# EasyEDA schematic Train_Barrier.json
TITLE: Train Barrier controler; REV: o.0; Date: 2022-07-04; Sheet: 1/1; Drawn By: AmirB@mada.org.il; Company: Blomfield Science Museum
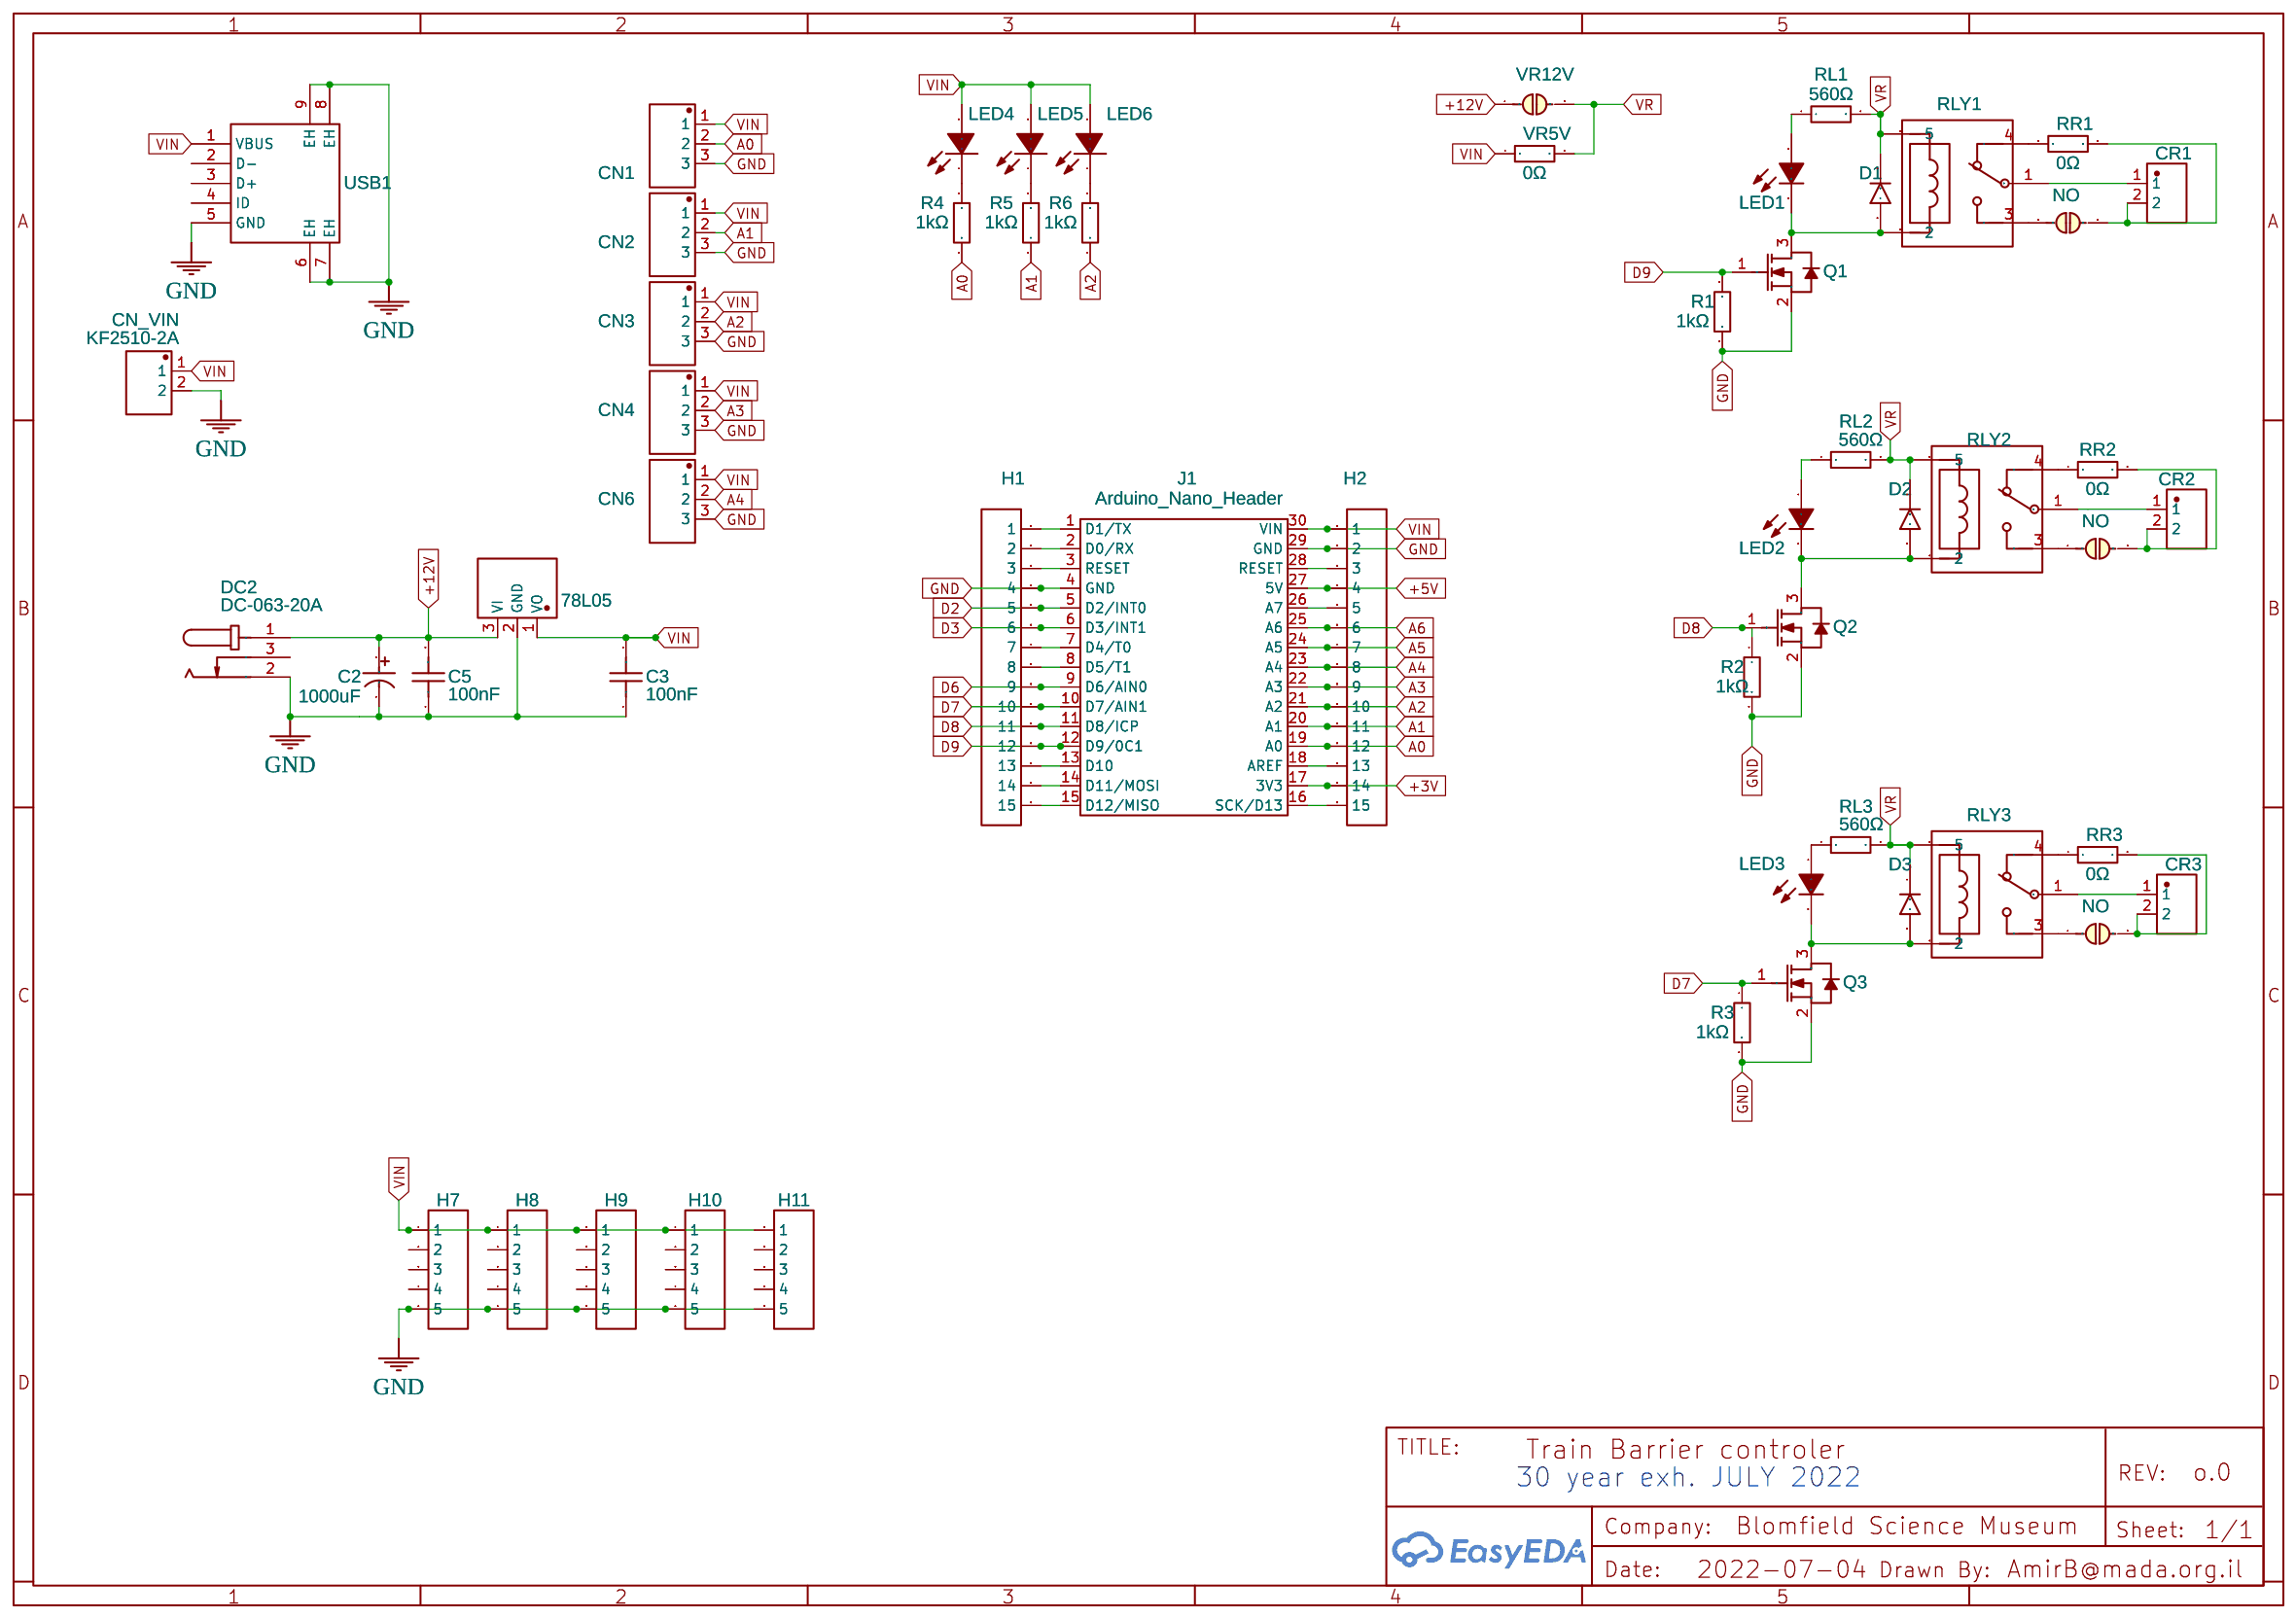
[diagram p0: schematic sheet]

## Parts
78L05  78L05_C842819  [SOT-89-3_L4.5-W2.5-P1.50-LS4.2-BR]
C2  1000uF  [CAP-TH_BD12.5-P5.00-D0.6-FD]
C3  100nF  [C0603]
C5  100nF  [C0603]
CN1  KF2510-3PFlat knitting needle  [CONN-TH_KF2510-3AW]
CN2  KF2510-3PFlat knitting needle  [CONN-TH_KF2510-3AW]
CN3  KF2510-3PFlat knitting needle  [CONN-TH_KF2510-3AW]
CN4  KF2510-3PFlat knitting needle  [CONN-TH_KF2510-3AW]
CN6  KF2510-3PFlat knitting needle  [CONN-TH_KF2510-3AW]
CN_VIN  KF2510-2A  [CONN-TH_KF2510-2A]
CR1  CR2  [CONN-TH_P5.00_KF301-5.0-2P]
CR2  CR2  [CONN-TH_P5.00_KF301-5.0-2P]
CR3  CR3  [CONN-TH_P5.00_KF301-5.0-2P]
D1  1N4007G  [SMA_L4.4-W2.6-LS5.0-RD]
D2  1N4007G  [SMA_L4.4-W2.6-LS5.0-RD]
D3  1N4007G  [SMA_L4.4-W2.6-LS5.0-RD]
DC2  DC-063-20A  [DC-IN-TH_DC-063-20A]
H1  HDR-F-2.54_1x15  [HDR-F-2.54_1X15]
H2  HDR-F-2.54_1x15  [HDR-F-2.54_1X15]
H7  HDR-F-2.54_1x5  [HDR-F-2.54_1X5]
H8  HDR-F-2.54_1x5  [HDR-F-2.54_1X5]
H9  HDR-F-2.54_1x5  [HDR-F-2.54_1X5]
H10  HDR-F-2.54_1x5  [HDR-F-2.54_1X5]
H11  HDR-F-2.54_1x5  [HDR-F-2.54_1X5]
J1  Arduino_Nano_Header  [DIP-30_L43.18-W15.24-ARDUINONANO]
J1V  NO  [JUMPERS_SMT-JUMPER_2_NC_PASTE_NO-SILK]
J2V  NO  [JUMPERS_SMT-JUMPER_2_NC_PASTE_NO-SILK]
J3V  NO  [JUMPERS_SMT-JUMPER_2_NC_PASTE_NO-SILK]
LED1  19-217/BHC-ZL1M2RY/3T  [LED0603-R-RD_BLUE]
LED2  19-217/BHC-ZL1M2RY/3T  [LED0603-R-RD_BLUE]
LED3  19-217/BHC-ZL1M2RY/3T  [LED0603-R-RD_BLUE]
LED4  FC-2012HRK-620D  [LED0805-RD_RED]
LED5  FC-2012HRK-620D  [LED0805-RD_RED]
LED6  FC-2012HRK-620D  [LED0805-RD_RED]
Q1  AO3400_C2938367  [SOT-23_L2.9-W1.3-P1.90-LS2.4-BR]
Q2  AO3400_C2938367  [SOT-23_L2.9-W1.3-P1.90-LS2.4-BR]
Q3  AO3400_C2938367  [SOT-23_L2.9-W1.3-P1.90-LS2.4-BR]
R1  1kΩ  [R0603]
R2  1kΩ  [R0603]
R3  1kΩ  [R0603]
R4  1kΩ  [R0603]
R5  1kΩ  [R0603]
R6  1kΩ  [R0603]
RL1  560Ω  [R0603]
RL2  560Ω  [R0603]
RL3  560Ω  [R0603]
RLY1  SRA-05VDC-CL blue  [RELAY-TH_SRA-9VDC-CL]
RLY2  SRA-05VDC-CL blue  [RELAY-TH_SRA-9VDC-CL]
RLY3  SRA-05VDC-CL blue  [RELAY-TH_SRA-9VDC-CL]
RR1  0Ω  [R0402]
RR2  0Ω  [R0402]
RR3  0Ω  [R0402]
USB1  KH-MICRO-SMT.J7.2-5P  [MICRO-USB-SMD_KH-MICRO-SMT.J7.2-5P]
VR5V  0Ω  [R0402]
VR12V  JUMPER-SMT_2  [JUMPERS_SMT-JUMPER_2_NC_PASTE_NO-SILK]

## Library data of the parts
78L05 = 78L05_C842819: Supplier: LCSC; Supplier Part: C842819; Manufacturer: FUXINSEMI; Contributor: LCSC; JLCPCB Part Class: Extended Part; Package Display: No
C2 = 1000uF 50V: Supplier: LCSC; Manufacturer: ValuePro; Supplier Part: C18104; JLCPCB Part Class: Extended Part; Package Display: No
C3 C5 = CC0603KRX7R9BB104: Supplier: LCSC; Manufacturer: YAGEO; Supplier Part: C14663; JLCPCB Part Class: Basic Part; Package Display: No
CN1-CN4 CN6 = KF2510-3PFlat knitting needle: Supplier: LCSC; Manufacturer: BOOMELE; Supplier Part: C45011; JLCPCB Part Class: Extended Part; Package Display: No
CN_VIN = KF2510-2A: Supplier: LCSC; Manufacturer: BOOMELE; Supplier Part: C27543; JLCPCB Part Class: Extended Part; Package Display: No
CR1-CR3 = KF301-5.0-2P: Supplier: LCSC; Supplier Part: C474881; Manufacturer: Cixi Kefa Elec; Contributor: LCSC; JLCPCB Part Class: Extended Part; Package Display: No
D1-D3 = 1N4007G: Supplier: LCSC; Manufacturer: SK; Contributor: LCSC; Supplier Part: C111122; JLCPCB Part Class: Extended Part; Package Display: No
DC2 = DC-063-20A: Supplier: LCSC; Supplier Part: C707268; Manufacturer: 韩国韩荣; Contributor: LCSC; JLCPCB Part Class: Extended Part; Package Display: No
H1 H2 = HDR-F-2.54_1x15: Supplier Part: C124408; Supplier: LCSC; Contributor: LCEDA_Lib; Package Display: No
H7-H11 = HDR-F-2.54_1x5: Supplier Part: C50950; Supplier: LCSC; Contributor: LCEDA_Lib; Package Display: No
J1 = Arduino_Nano_Header
J1V J2V J3V VR12V = JUMPER-SMT_2: Contributor: P-Thomsen; Package Display: No
LED1-LED3 = 19-217/BHC-ZL1M2RY/3T: Supplier: LCSC; Manufacturer: EVERLIGHT; Supplier Part: C72041; JLCPCB Part Class: Basic Part; Package Display: No
LED4-LED6 = FC-2012HRK-620D: Supplier: LCSC; Manufacturer: NATIONSTAR; Supplier Part: C84256; JLCPCB Part Class: Basic Part; Package Display: No
Q1-Q3 = AO3400_C2938367: Supplier: LCSC; Supplier Part: C2938367; Manufacturer: GOODWORK(固得沃克); Manufacturer Part: AO3400; Contributor: LCSC; JLCPCB Part Class: Extended Part; Package Display: No
R1-R6 = 0603WAF1001T5E: Supplier: LCSC; Manufacturer: UniOhm; Supplier Part: C21190; Resistance (Ohms): 1K; JLCPCB Part Class: Basic Part; Package Display: No
RL1-RL3 = 0603WAF5600T5E: Supplier: LCSC; Manufacturer: UniOhm; Supplier Part: C23204; Resistance (Ohms): 560; JLCPCB Part Class: Basic Part; Package Display: No
RLY1-RLY3 = SRA-05VDC-CL blue: Supplier: LCSC; Manufacturer: SONGLE; Supplier Part: C87714; JLCPCB Part Class: Extended Part; Package Display: No
RR1-RR3 VR5V = 0402WGF0000TCE: Supplier: LCSC; Manufacturer: UniOhm; Supplier Part: C17168; Resistance (Ohms): 0; JLCPCB Part Class: Basic Part; Package Display: No
USB1 = KH-MICRO-SMT.J7.2-5P: Supplier: LCSC; Supplier Part: C2688801; Manufacturer: kinghelm(金航标); Contributor: LCSC; JLCPCB Part Class: Extended Part; Package Display: No

## Nets
+3V: H2.14 J1.17(3V3)
+5V: H2.4 J1.27(5V)
+12V: 78L05.3(VI) C2.1 C5.2 DC2.1 VR12V.1
GND: 78L05.2(GND) C2.2 C3.1 C5.1 CN1.3 CN2.3 CN3.3 CN4.3 CN6.3 CN_VIN.2 DC2.2 H1.4 H2.2 H7.5 H8.5 H9.5 H10.5 H11.5 J1.4(GND) J1.29(GND) Q1.2(S) Q2.2(S) Q3.2(S) R1.1 R2.2 R3.2 USB1.5(GND) USB1.6(EH) USB1.7(EH) USB1.8(EH) USB1.9(EH)
VIN: 78L05.1(VO) C3.2 CN1.1 CN2.1 CN3.1 CN4.1 CN6.1 CN_VIN.1 H2.1 H7.1 H8.1 H9.1 H10.1 H11.1 J1.30(VIN) LED4.2(+) LED5.2(+) LED6.2(+) USB1.1(VBUS) VR5V.1
A0: CN1.2 H2.12 J1.19(A0) R4.2
A1: CN2.2 H2.11 J1.20(A1) R5.2
A2: CN3.2 H2.10 J1.21(A2) R6.2
A3: CN4.2 H2.9 J1.22(A3)
A4: CN6.2 H2.8 J1.23(A4)
A5: H2.7 J1.24(A5)
A6: H2.6 J1.25(A6)
D2: H1.5 J1.5(D2/INT0)
D3: H1.6 J1.6(D3/INT1)
D6: H1.9 J1.9(D6/AIN0)
D7: H1.10 J1.10(D7/AIN1) Q3.1(G) R3.1
D8: H1.11 J1.11(D8/ICP) Q2.1(G) R2.1
D9: H1.12 J1.12(D9/0C1) Q1.1(G) R1.2
VR: D1.1(C) D2.1(C) D3.1(C) RL1.2 RL2.2 RL3.2 RLY1.5 RLY2.5 RLY3.5 VR5V.2 VR12V.2
Net-(CR1-1): CR1.1 RLY1.1
Net-(CR1-2): CR1.2 J1V.2 RR1.2
Net-(CR2-1): CR2.1 RLY2.1
Net-(CR2-2): CR2.2 J2V.2 RR2.2
Net-(CR3-1): CR3.1 RLY3.1
Net-(CR3-2): CR3.2 J3V.2 RR3.2
Net-(D1-2): D1.2(A) LED1.2(C) Q1.3(D) RLY1.2
Net-(D2-2): D2.2(A) LED2.2(C) Q2.3(D) RLY2.2
Net-(D3-2): D3.2(A) LED3.2(C) Q3.3(D) RLY3.2
Net-(H1-1): H1.1 J1.1(D1/TX)
Net-(H1-2): H1.2 J1.2(D0/RX)
Net-(H1-3): H1.3 J1.3(RESET)
Net-(H1-7): H1.7 J1.7(D4/T0)
Net-(H1-8): H1.8 J1.8(D5/T1)
Net-(H1-13): H1.13 J1.13(D10)
Net-(H1-14): H1.14 J1.14(D11/MOSI)
Net-(H1-15): H1.15 J1.15(D12/MISO)
Net-(H2-3): H2.3 J1.28(RESET)
Net-(H2-5): H2.5 J1.26(A7)
Net-(H2-13): H2.13 J1.18(AREF)
Net-(H2-15): H2.15 J1.16(SCK/D13)
Net-(J1V-1): J1V.1 RLY1.3
Net-(J2V-1): J2V.1 RLY2.3
Net-(J3V-1): J3V.1 RLY3.3
Net-(LED1-1): LED1.1(A) RL1.1
Net-(LED2-1): LED2.1(A) RL2.1
Net-(LED3-1): LED3.1(A) RL3.1
Net-(LED4-1): LED4.1(-) R4.1
Net-(LED5-1): LED5.1(-) R5.1
Net-(LED6-1): LED6.1(-) R6.1
Net-(RLY1-4): RLY1.4 RR1.1
Net-(RLY2-4): RLY2.4 RR2.1
Net-(RLY3-4): RLY3.4 RR3.1

Not connected (* = marked no-connect by the designer): DC2 3; H7 2 3 4; H8 2 3 4; H9 2 3 4; H10 2 3 4; H11 2 3 4; USB1 2(D-) 3(D+) 4(ID)

## Notes on the sheet
- 30 year exh. JULY 2022
